# EAGLE design TMR2017 (EAGLE 7.7.0)
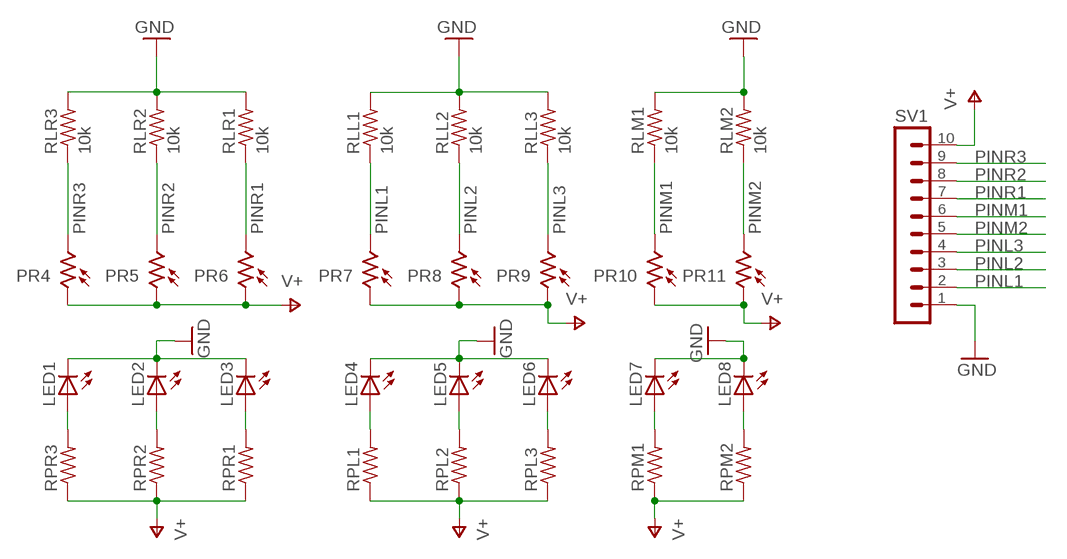
[diagram p0: schematic, sheet 1]

## Parts
LED1  TLLR4400  [LED3MM]
LED2  TLLR4400  [LED3MM]
LED3  TLLR4400  [LED3MM]
LED4  TLLR4400  [LED3MM]
LED5  TLLR4400  [LED3MM]
LED6  TLLR4400  [LED3MM]
LED7  TLLR4400  [LED3MM]
LED8  TLLR4400  [LED3MM]
PR4  VT80N1  [VT800]
PR5  VT80N1  [VT800]
PR6  VT80N1  [VT800]
PR7  VT80N1  [VT800]
PR8  VT80N1  [VT800]
PR9  VT80N1  [VT800]
PR10  VT80N1  [VT800]
PR11  VT80N1  [VT800]
RLL1  10k  R-US_0207/10  [0207/10]
RLL2  10k  R-US_0207/10  [0207/10]
RLL3  10k  R-US_0207/10  [0207/10]
RLM1  10k  R-US_0207/10  [0207/10]
RLM2  10k  R-US_0207/10  [0207/10]
RLR1  10k  R-US_0207/10  [0207/10]
RLR2  10k  R-US_0207/10  [0207/10]
RLR3  10k  R-US_0207/10  [0207/10]
RPL1  R-US_0207/10  [0207/10]
RPL2  R-US_0207/10  [0207/10]
RPL3  R-US_0207/10  [0207/10]
RPM1  R-US_0207/10  [0207/10]
RPM2  R-US_0207/10  [0207/10]
RPR1  R-US_0207/10  [0207/10]
RPR2  R-US_0207/10  [0207/10]
RPR3  R-US_0207/10  [0207/10]
SV1  MA10-1  [MA10-1]

## Nets
GND: LED1.K(C) LED2.K(C) LED3.K(C) LED4.K(C) LED5.K(C) LED6.K(C) LED7.K(C) LED8.K(C) RLL1.2 RLL2.2 RLL3.2 RLM1.2 RLM2.2 RLR1.2 RLR2.2 RLR3.2 SV1.1
N$1: LED1.A RPR3.2
N$2: LED2.A RPR2.2
N$3: LED3.A RPR1.2
N$4: LED4.A RPL1.2
N$5: LED5.A RPL2.2
N$6: LED6.A RPL3.2
N$7: LED7.A RPM1.2
N$8: LED8.A RPM2.2
PINL1: PR7.2 RLL1.1 SV1.2
PINL2: PR8.2 RLL2.1 SV1.3
PINL3: PR9.2 RLL3.1 SV1.4
PINM1: PR10.2 RLM1.1 SV1.6
PINM2: PR11.2 RLM2.1 SV1.5
PINR1: PR6.2 RLR1.1 SV1.7
PINR2: PR5.2 RLR2.1 SV1.8
PINR3: PR4.2 RLR3.1 SV1.9
V+: PR4.1 PR5.1 PR6.1 PR7.1 PR8.1 PR9.1 PR10.1 PR11.1 RPL1.1 RPL2.1 RPL3.1 RPM1.1 RPM2.1 RPR1.1 RPR2.1 RPR3.1 SV1.10

## Library data of the parts
LED1-LED8 = led:TLLR4400: Low Current (2mA) LED 3 mm Tinted Diffused Package color RED Source: Data sheet <http://www.farnell.com/datasheets/391100.pdf>; MF: VISHAY SEMICONDUCTOR; OC_FARNELL: 1612437
PR4-PR11 = photo-elements:VT8: Photoconductive Cell VT800 Series Source: http://optoelectronics.perkinelmer.com/content/Datasheets/DTS_vt800seriesdatasheet.pdf
RLL1-RLL3 RLM1 RLM2 RLR1-RLR3 RPL1-RPL3 RPM1 RPM2 RPR1-RPR3 = rcl:R-US_: RESISTOR, American symbol
SV1 = con-lstb:MA10-1: PIN HEADER; OC_FARNELL: unknown; OC_NEWARK: unknown

## Board
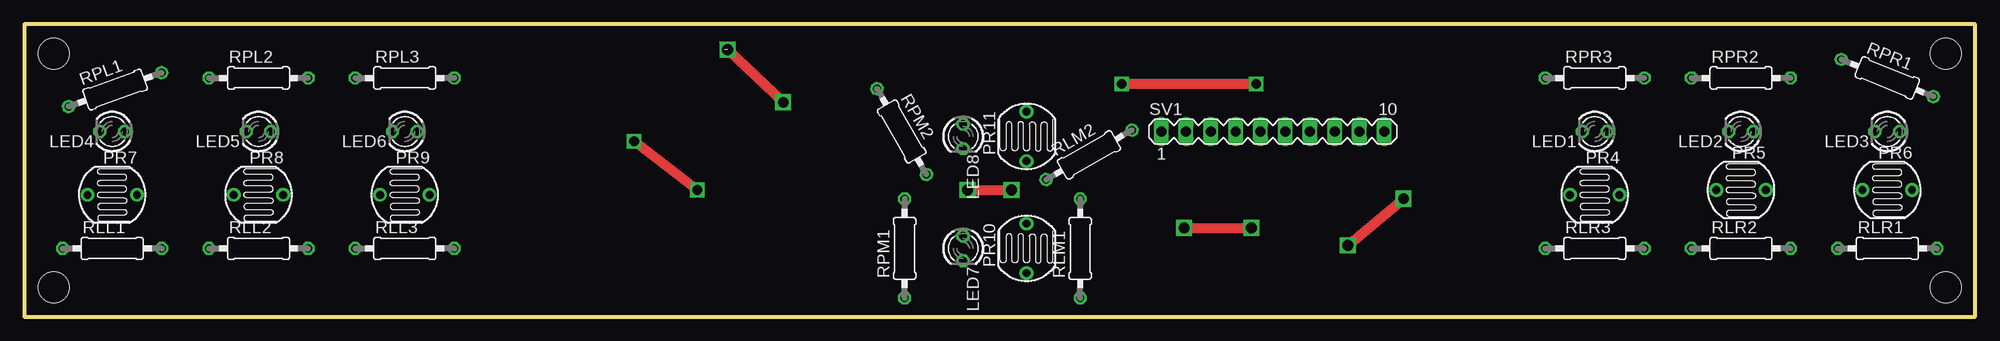
[diagram p1: board, top side]
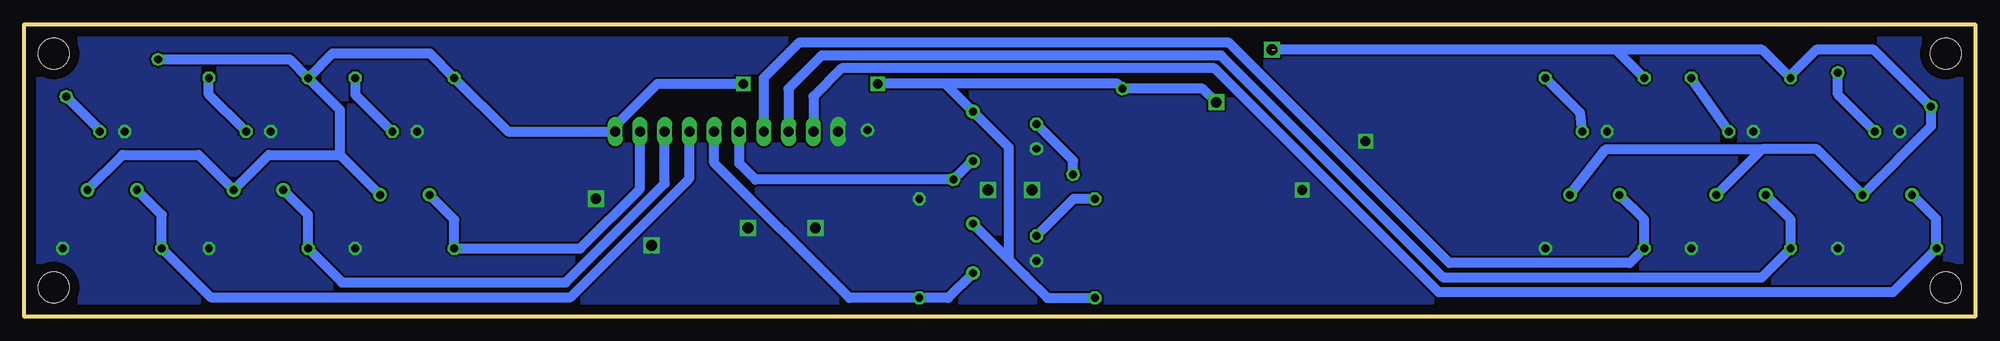
[diagram p2: board, bottom side, seen from below]

Size 200 x 30 mm. Coordinates in mm from the lower left corner, seen from the top.
Outline: 200,0 200,30 0,30 0,0 200,0
Copper layers (1*16): Top 0.035mm / dielectric 1.5mm / Bottom 0.035mm
Design rules "default": minimum track width 10mil, minimum drill 24mil, track to track 8mil, track to pad 8mil, pad to pad 8mil, via to via 8mil, smd to smd 8mil, copper to edge 40mil, drill to drill 8mil, minimum pad ring 10mil, minimum via ring 8mil, stop-mask expansion 4mil, vias tented up to drill 0mil, thermal gap 10mil
Holes 3.2 mm at 3,27 3,3 197,3 197,27

### Footprints (pad centres in the part's own frame; a part is rotated, then mirrored left to right if it is on the bottom)
LED3MM = drill 0.813 octagon: A -1.27,0; K 1.27,0
VT800 = drill 0.8 pad 1.4: 1 -2.54,0; 2 2.54,0
0207/10 = drill 0.813 octagon: 1 -5.08,0; 2 5.08,0
MA10-1 = drill 1.016 long: 1 -11.43,0; 2 -8.89,0; 3 -6.35,0; 4 -3.81,0; 5 -1.27,0; 6 1.27,0; 7 3.81,0; 8 6.35,0; 9 8.89,0; 10 11.43,0

### Placement (x,y rotation side)
LED1  161,19 180 top
LED2  176,19 180 top
LED3  191,19 180 top
LED4  9,19 180 top
LED5  24,19 180 top
LED6  39,19 180 top
LED7  96.25,7 270 top
LED8  96.25,18.5 270 top
PR4  161,12.5 180 top
PR5  176,13 180 top
PR6  191,13 180 top
PR7  9,12.5 180 top
PR8  24,12.5 180 top
PR9  39,12.5 180 top
PR10  102.75,7 270 top
PR11  102.75,18.5 270 top
RLL1  9,7 0 top
RLL2  24,7 0 top
RLL3  39,7 0 top
RLM1  108.25,7 90 top
RLM2  109.15,16.6 30 top
RLR1  191,7 0 top
RLR2  176,7 0 top
RLR3  161,7 0 top
RPL1  9.3,23.3 20 top
RPL2  24,24.5 0 top
RPL3  39,24.5 0 top
RPM1  90.25,7 90 top
RPM2  89.95,19 300 top
RPR1  191,24.5 338 top
RPR2  176,24.5 0 top
RPR3  161,24.5 0 top
SV1  128,19 0 top

### Tracks (layer width: path | path; a pad name or v marks a point on that pad's centre or on a via)
GND  (via drill 1, 1.1)
  Top 1.016: v62.5,18 v69,13 | v96.7,13 v101.2,13 | v118.9,9.1 v125.8,9.1 | v135.7,7.3 v141.4,12.1
  pour Bottom (no thermals): 0.3,30 200,30 200,0 0,0
N$1
  Bottom 1.016: RPR3.2 166.08,22.81 LED1.A
N$2
  Bottom 1.016: LED2.A 181.08,22.81 RPR2.2
N$3
  Bottom 1.016: LED3.A 192.27,19.16 RPR1.2
N$4
  Bottom 1.016: LED4.A 14.07,22.8 RPL1.2
N$5
  Bottom 1.016: LED5.A 29.08,24.41 RPL2.2
N$6
  Bottom 1.016: LED6.A 40.48,20.9 RPL3.2
N$7
  Bottom 1.016: RPM1.2 92.44,12.08 LED7.A
N$8
  Bottom 1.016: RPM2.2 92.49,16.01 LED8.A
PINL1
  Bottom 1.016: SV1.2 119.1,22.6 116.2,25.5 78,25.5 55,2.5 8.42,2.5 RLL1.1 4,7 4,10.04 PR7.2
PINL2
  Bottom 1.016: 121.7,19.05 SV1.3 121.67,19.02 121.67,23.39 118.26,26.8 77.3,26.8 54.5,4 21.92,4 RLL2.1 18.92,9.96 PR8.2
PINL3
  Bottom 1.016: SV1.4 124.2,24.5 120.6,28.1 76.5,28.1 53.9,5.5 35.42,5.5 RLL3.1 33.92,9.96 PR9.2
PINM1
  Bottom 1.016: SV1.6 129.27,15.77 115.42,1.92 RLM1.1 105.29,1.92 PR10.2
PINM2
  Bottom 1.016: SV1.5 126.7,18.97 126.7,15.7 125.06,14.06 RLM2.1 102.85,15.96 PR11.2
PINR1
  Bottom 1.016: SV1.7 131.81,14.19 144,2 180.92,2 RLR1.1 185.92,10.46 PR6.2
PINR2
  Bottom 1.016: SV1.8 134.35,13.65 144.5,3.5 167.42,3.5 RLR2.1 170.92,10.46 PR5.2
PINR3
  Bottom 1.016: SV1.9 136.89,13.11 143,7 RLR3.1 155.92,9.96 PR4.2
V+  (via drill 1, 1.1)  (1 unrouted)
  Top 1.016: v112.5,23.9 v126.3,23.9 | v72.1,27.4 v77.8,22
  Bottom 1.016: RPR1.1 172.82,26.4 RPR2.1 | RPR2.1 168.42,27 158.42,27 RPR3.1 150.42,19 SV1.10 139.43,19.57 135.1,23.9 v126.3,23.9 | 36.82,27.4 21.82,27.4 RPL2.1 18.92,24.78 16.3,27.4 10.36,27.4 RPL1.1 4.53,19.51 PR7.1 16.24,17.2 21.84,17.2 | RPL3.1 36.82,27.4 | 36.82,27.4 71.8,27.4 | 26.4,12.5 PR8.1 21.84,17.2 | PR9.1 37.84,17.2 21.84,17.2 | v77.8,22 79.2,23.4 RPM2.1 87.91,23.9 v112.5,23.9 105.61,23.9 PR11.1 99.1,17.39 99.1,5.89 | PR10.1 99.1,5.89 | RPM1.1 95.13,1.92 97.41,4.2 99.1,5.89 | PR6.1 189.94,16.6 182.14,16.6 PR5.1 174.94,16.6 167.64,16.6 | 167.64,16.6 PR4.1 | 167.64,16.6 167.64,21.22 RPR2.1